# EAGLE schematic STOPBAND_FILTER (EAGLE 9.6.2)
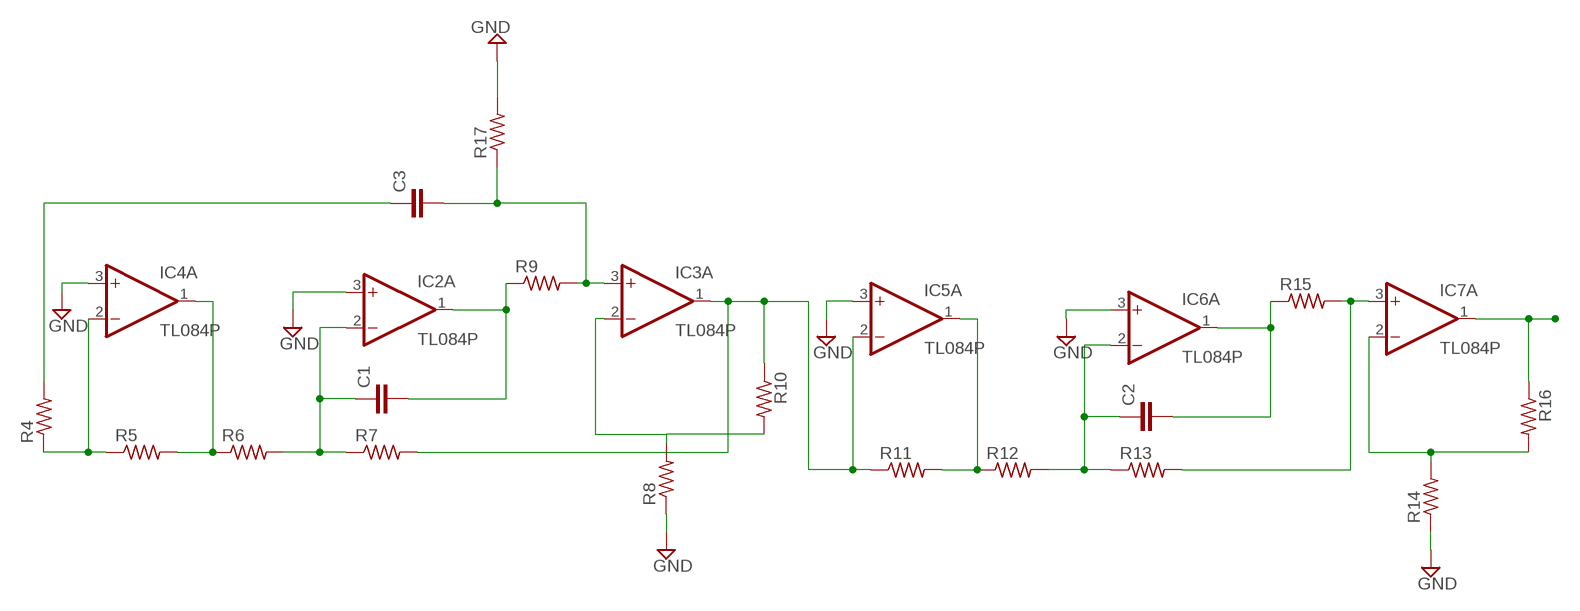
[diagram p0: schematic, sheet 1]

## Parts
C1  C-EU050-030X075  [C050-030X075]
C2  C-EU050-030X075  [C050-030X075]
C3  C-EU050-030X075  [C050-030X075]
IC2  TL084P  [DIL14]
IC3  TL084P  [DIL14]
IC4  TL084P  [DIL14]
IC5  TL084P  [DIL14]
IC6  TL084P  [DIL14]
IC7  TL084P  [DIL14]
R4  R-US_0204/5  [0204/5]
R5  R-US_0204/5  [0204/5]
R6  R-US_0204/5  [0204/5]
R7  R-US_0204/5  [0204/5]
R8  R-US_0204/5  [0204/5]
R9  R-US_0204/5  [0204/5]
R10  R-US_0204/5  [0204/5]
R11  R-US_0204/5  [0204/5]
R12  R-US_0204/5  [0204/5]
R13  R-US_0204/5  [0204/5]
R14  R-US_0204/5  [0204/5]
R15  R-US_0204/5  [0204/5]
R16  R-US_0204/5  [0204/5]
R17  R-US_0204/5  [0204/5]

## Nets
GND: IC2.3(A:+IN) IC4.3(A:+IN) IC5.3(A:+IN) IC6.3(A:+IN) R8.1 R14.1 R17.2
N$4: IC4.2(A:-IN) R4.1 R5.1
N$5: C3.1 R4.2
N$6: IC4.1(A:OUT) R5.2 R6.1
N$7: C3.2 IC3.3(A:+IN) R9.2 R17.1
N$8: C1.2 IC2.1(A:OUT) R9.1
N$9: C1.1 IC2.2(A:-IN) R6.2 R7.1
N$10: IC3.2(A:-IN) R8.2 R10.2
N$12: IC3.1(A:OUT) IC5.2(A:-IN) R7.2 R10.1 R11.1
N$13: IC5.1(A:OUT) R11.2 R12.1
N$14: C2.1 IC6.2(A:-IN) R12.2 R13.1
N$15: IC7.3(A:+IN) R13.2 R15.2
N$16: C2.2 IC6.1(A:OUT) R15.1
N$17: IC7.1(A:OUT) R16.1
N$18: IC7.2(A:-IN) R14.2 R16.2
Unconnected: IC2.5(B:+IN) IC2.6(B:-IN) IC2.7(B:OUT) IC2.8(C:OUT) IC2.9(C:-IN) IC2.10(C:+IN) IC2.12(D:+IN) IC2.13(D:-IN) IC2.14(D:OUT) IC3.5(B:+IN) IC3.6(B:-IN) IC3.7(B:OUT) IC3.8(C:OUT) IC3.9(C:-IN) IC3.10(C:+IN) IC3.12(D:+IN) IC3.13(D:-IN) IC3.14(D:OUT) IC4.5(B:+IN) IC4.6(B:-IN) IC4.7(B:OUT) IC4.8(C:OUT) IC4.9(C:-IN) IC4.10(C:+IN) IC4.12(D:+IN) IC4.13(D:-IN) IC4.14(D:OUT) IC5.5(B:+IN) IC5.6(B:-IN) IC5.7(B:OUT) IC5.8(C:OUT) IC5.9(C:-IN) IC5.10(C:+IN) IC5.12(D:+IN) IC5.13(D:-IN) IC5.14(D:OUT) IC6.5(B:+IN) IC6.6(B:-IN) IC6.7(B:OUT) IC6.8(C:OUT) IC6.9(C:-IN) IC6.10(C:+IN) IC6.12(D:+IN) IC6.13(D:-IN) IC6.14(D:OUT) IC7.5(B:+IN) IC7.6(B:-IN) IC7.7(B:OUT) IC7.8(C:OUT) IC7.9(C:-IN) IC7.10(C:+IN) IC7.12(D:+IN) IC7.13(D:-IN) IC7.14(D:OUT)

## Power pins joined to a net without a drawn wire
V+: IC2.4(P:V+) IC3.4(P:V+) IC4.4(P:V+) IC5.4(P:V+) IC6.4(P:V+) IC7.4(P:V+)
V-: IC2.11(P:V-) IC3.11(P:V-) IC4.11(P:V-) IC5.11(P:V-) IC6.11(P:V-) IC7.11(P:V-)

## Library data of the parts
C1-C3 = rcl:C-EU: CAPACITOR, European symbol; SPICEPREFIX: C
IC2-IC7 = linear:TL084: OP AMP
R4-R17 = rcl:R-US_: RESISTOR, American symbol; SPICEPREFIX: R